# Altium schematic sheet Line_detector_sensor.SchDoc
size A3; SheetNumber: 1; SheetTotal: 1
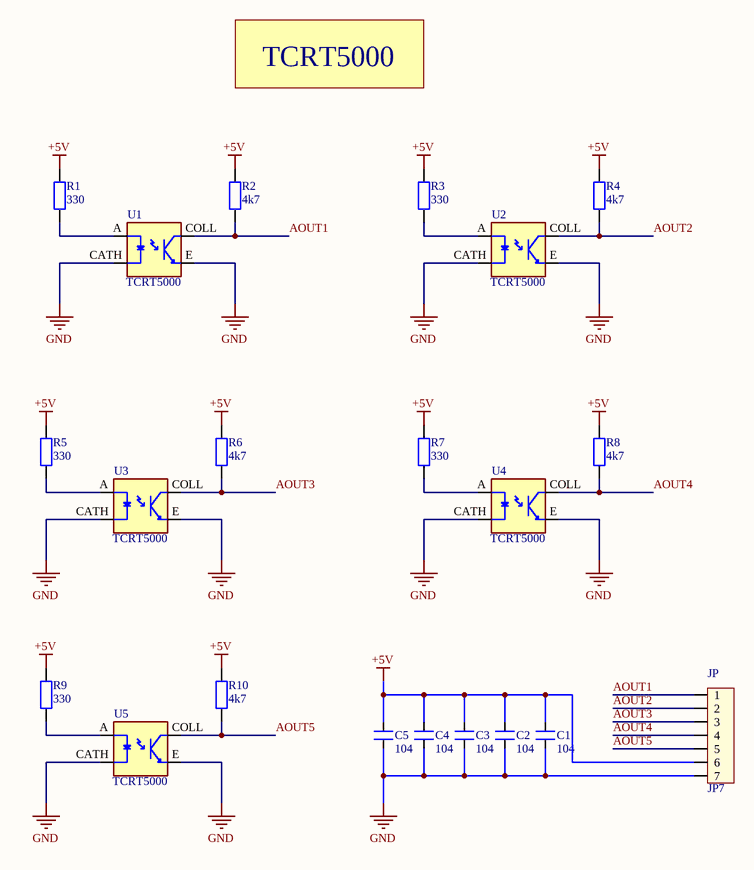
[diagram p0: Line_detector_sensor.SchDoc]

## Parts
C1  104  [CN2]
C2  104  [CN2]
C3  104  [CN2]
C4  104  [CN2]
C5  104  [CN2]
JP  JP7  [CON7]
R1  330  [R1/4W]
R2  4k7  [R1/4W]
R3  330  [R1/4W]
R4  4k7  [R1/4W]
R5  330  [R1/4W]
R6  4k7  [R1/4W]
R7  330  [R1/4W]
R8  4k7  [R1/4W]
R9  330  [R1/4W]
R10  4k7  [R1/4W]
U1  TCRT5000  [OPTO_TCRT5000]
U2  TCRT5000  [OPTO_TCRT5000]
U3  TCRT5000  [OPTO_TCRT5000]
U4  TCRT5000  [OPTO_TCRT5000]
U5  TCRT5000  [OPTO_TCRT5000]

## Nets
+5V: C1.2 C2.2 C3.2 C4.2 C5.2 JP.6 R1.2 R2.2 R3.2 R4.2 R5.2 R6.2 R7.2 R8.2 R9.2 R10.2
GND: C1.1 C2.1 C3.1 C4.1 C5.1 JP.7 U1.CATH U1.E U2.CATH U2.E U3.CATH U3.E U4.CATH U4.E U5.CATH U5.E
AOUT1: JP.1 R2.1 U1.COLL
AOUT2: JP.2 R4.1 U2.COLL
AOUT3: JP.3 R6.1 U3.COLL
AOUT4: JP.4 R8.1 U4.COLL
AOUT5: JP.5 R10.1 U5.COLL
NetR1_1: R1.1 U1.A
NetR3_1: R3.1 U2.A
NetR5_1: R5.1 U3.A
NetR7_1: R7.1 U4.A
NetR9_1: R9.1 U5.A

## Notes on the sheet
- TCRT5000

## Library data of the parts
C1-C5 = CN2: Cap np 104 => 105pF; Value: 0.1uF
JP = Con7: Connector 7; Value: Connector 7
R1-R10 = R1/4W: Resistor 1/4W; Value: R1/4W - 1K
U1-U5 = TCRT5000: 950 nm 60 mA Through Hole Reflective Optical Sensor with Transistor Output; Value: *; Availability: Unavailable; Price: None; Package: None; MP: TCRT5000